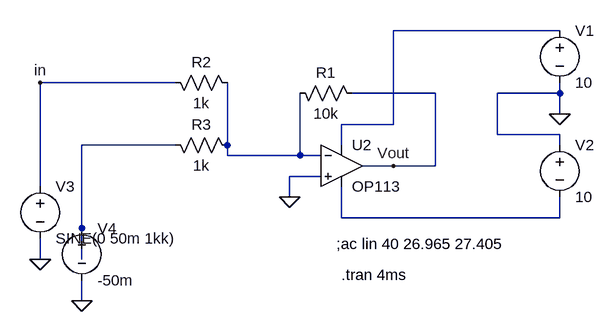
[diagram p0: schematic OperationalAmplifier.asc]
OperationalAmplifier.asc, the LTspice schematic file:
Version 4
SHEET 1 880 680
WIRE 624 -32 368 -32
WIRE 32 48 -176 48
WIRE 432 64 304 64
WIRE 624 64 624 48
WIRE 624 64 528 64
WIRE 624 96 624 64
WIRE 368 112 368 -32
WIRE 368 112 288 112
WIRE 528 128 528 64
WIRE 624 128 528 128
WIRE 32 144 -112 144
WIRE 112 144 112 48
WIRE 288 144 288 112
WIRE 624 144 624 128
WIRE 112 160 112 144
WIRE 224 160 224 64
WIRE 224 160 112 160
WIRE 256 160 224 160
WIRE 368 176 320 176
WIRE 432 176 432 64
WIRE 432 176 368 176
WIRE 256 192 208 192
WIRE -176 208 -176 48
WIRE 208 224 208 192
WIRE 288 256 288 208
WIRE 624 256 624 224
WIRE 624 256 288 256
WIRE -112 272 -112 144
WIRE -176 320 -176 288
WIRE -112 320 -112 272
WIRE -112 384 -112 352
FLAG 208 224 0
FLAG 624 96 0
FLAG -176 320 0
FLAG -112 384 0
FLAG 368 176 Vout
FLAG -176 48 in
SYMBOL OP113 288 112 R0
SYMATTR InstName U2
SYMBOL res 208 48 M90
WINDOW 0 0 56 VBottom 2
WINDOW 3 32 56 VTop 2
SYMATTR InstName R1
SYMATTR Value 10k
SYMBOL res 16 32 M90
WINDOW 0 0 56 VBottom 2
WINDOW 3 32 56 VTop 2
SYMATTR InstName R2
SYMATTR Value 1k
SYMBOL res 16 128 M90
WINDOW 0 0 56 VBottom 2
WINDOW 3 32 56 VTop 2
SYMATTR InstName R3
SYMATTR Value 1k
SYMBOL voltage 624 -48 R0
WINDOW 123 0 0 Left 0
WINDOW 39 0 0 Left 0
SYMATTR InstName V1
SYMATTR Value 10
SYMBOL voltage 624 128 R0
WINDOW 123 0 0 Left 0
WINDOW 39 0 0 Left 0
SYMATTR InstName V2
SYMATTR Value 10
SYMBOL voltage -176 192 R0
SYMATTR InstName V3
SYMATTR Value SINE(0 50m 1kk)
SYMATTR Value2 AC 50m
SYMBOL voltage -112 256 R0
SYMATTR InstName V4
SYMATTR Value -50m
TEXT 280 296 Left 2 !;ac lin 40 26.965 27.405
TEXT 288 344 Left 2 !.tran 4ms

The netlist it stands for:
* OperationalAmplifier.asc
XU2 0 N003 N001 N004 Vout OP113  ; pins In+ In- V+ V- OUT
R1 N003 Vout 10k
R2 in N003 1k
R3 N002 N003 1k
V1 N001 0 10
V2 0 N004 10
V3 in 0 SINE(0 50m 1kk) AC 50m
V4 N002 0 -50m
;ac lin 40 26.965 27.405
.tran 4ms
.lib ADI.lib
.backanno
.end